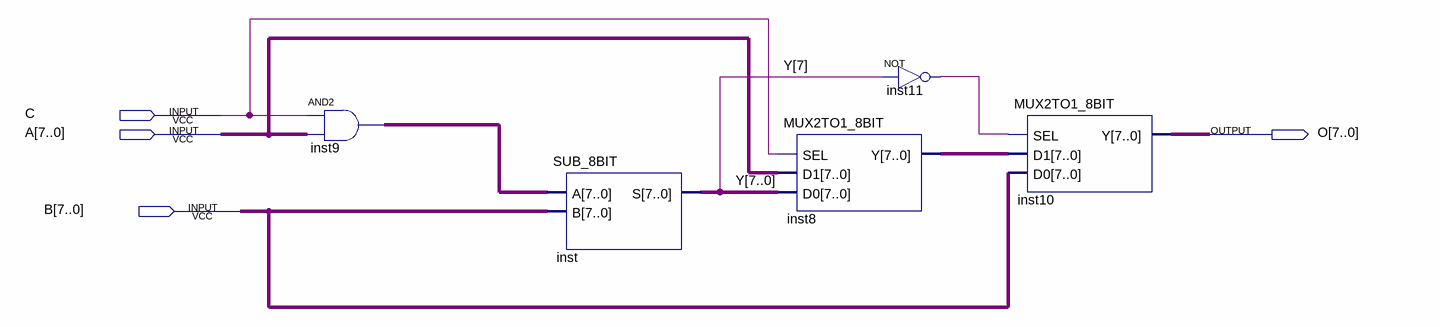
[diagram p0: schematic sheet]
// Quartus schematic MaxAbs.bdf as structural Verilog: 5 symbols, 4 pins
module MaxAbs (
  input  C,
  input  [7:0] A,
  input  [7:0] B,
  output [7:0] O
);

  wire inst11_out;
  wire [7:0] inst8_y, inst9_out, Y;

  assign inst9_out = {8{C}} & A;  // AND2 inst9, 8 bits wide
  SUB_8BIT inst (.A(inst9_out), .B(B), .S(Y));
  MUX2TO1_8BIT inst8 (.SEL(C), .D1(A), .D0(Y), .Y(inst8_y));
  not inst11 (inst11_out, Y[7]);
  MUX2TO1_8BIT inst10 (.SEL(inst11_out), .D1(inst8_y), .D0(B), .Y(O));
endmodule
